# EAGLE schematic glassesBoard (EAGLE 9.2.2)
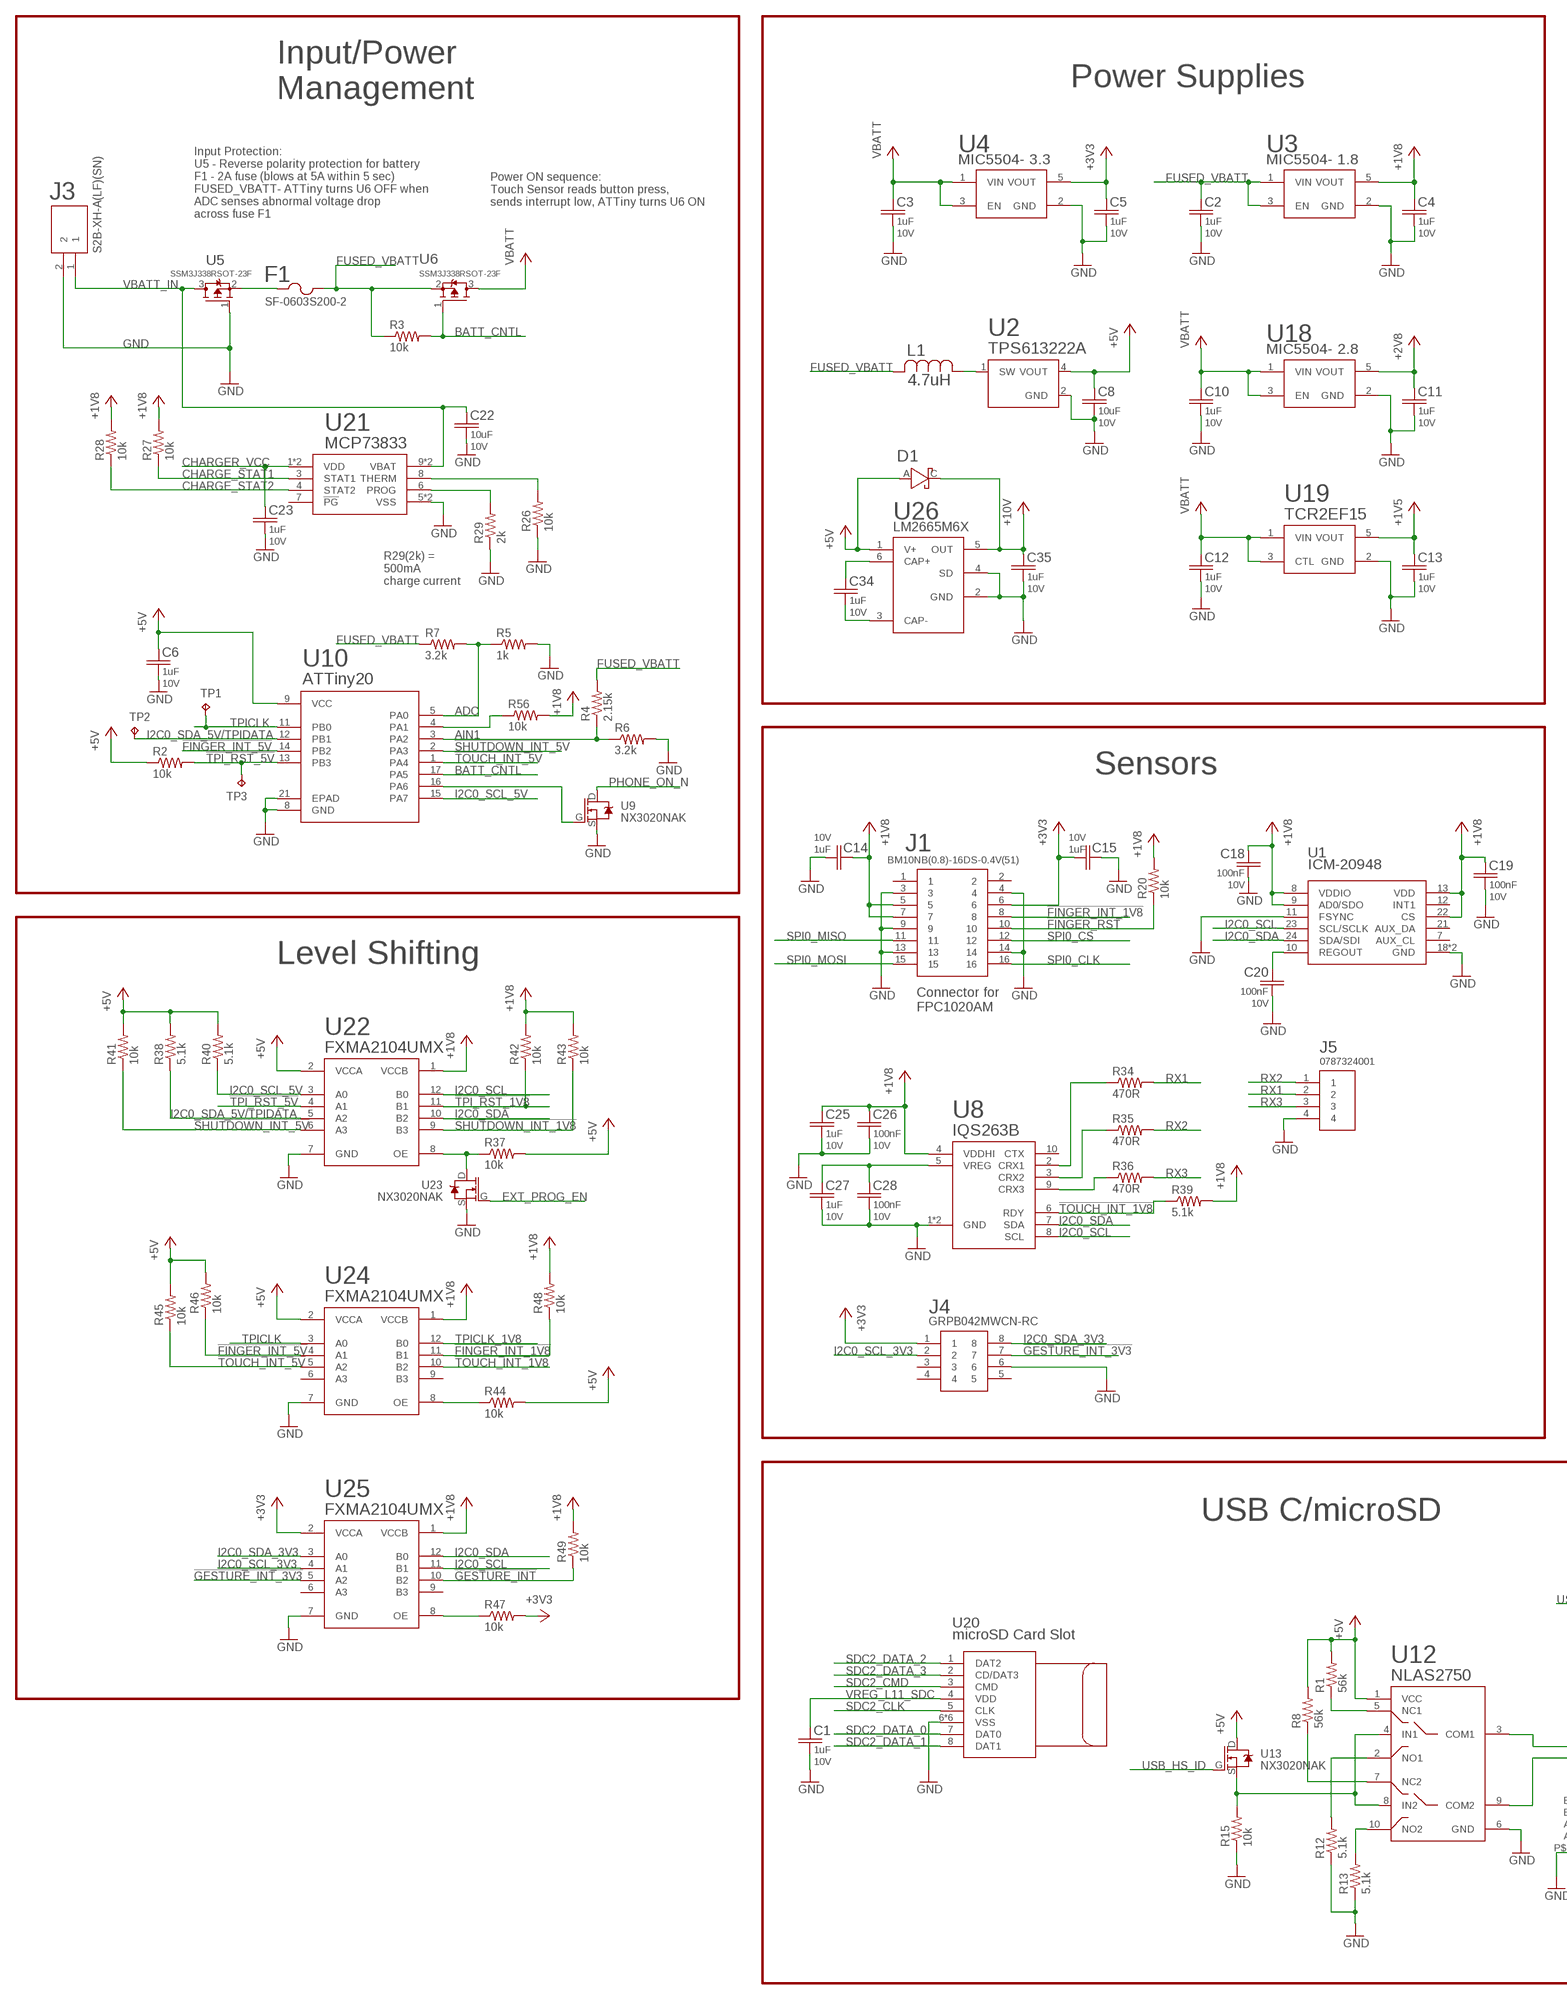
[diagram p0: schematic, sheet 1, part 1 of 2]
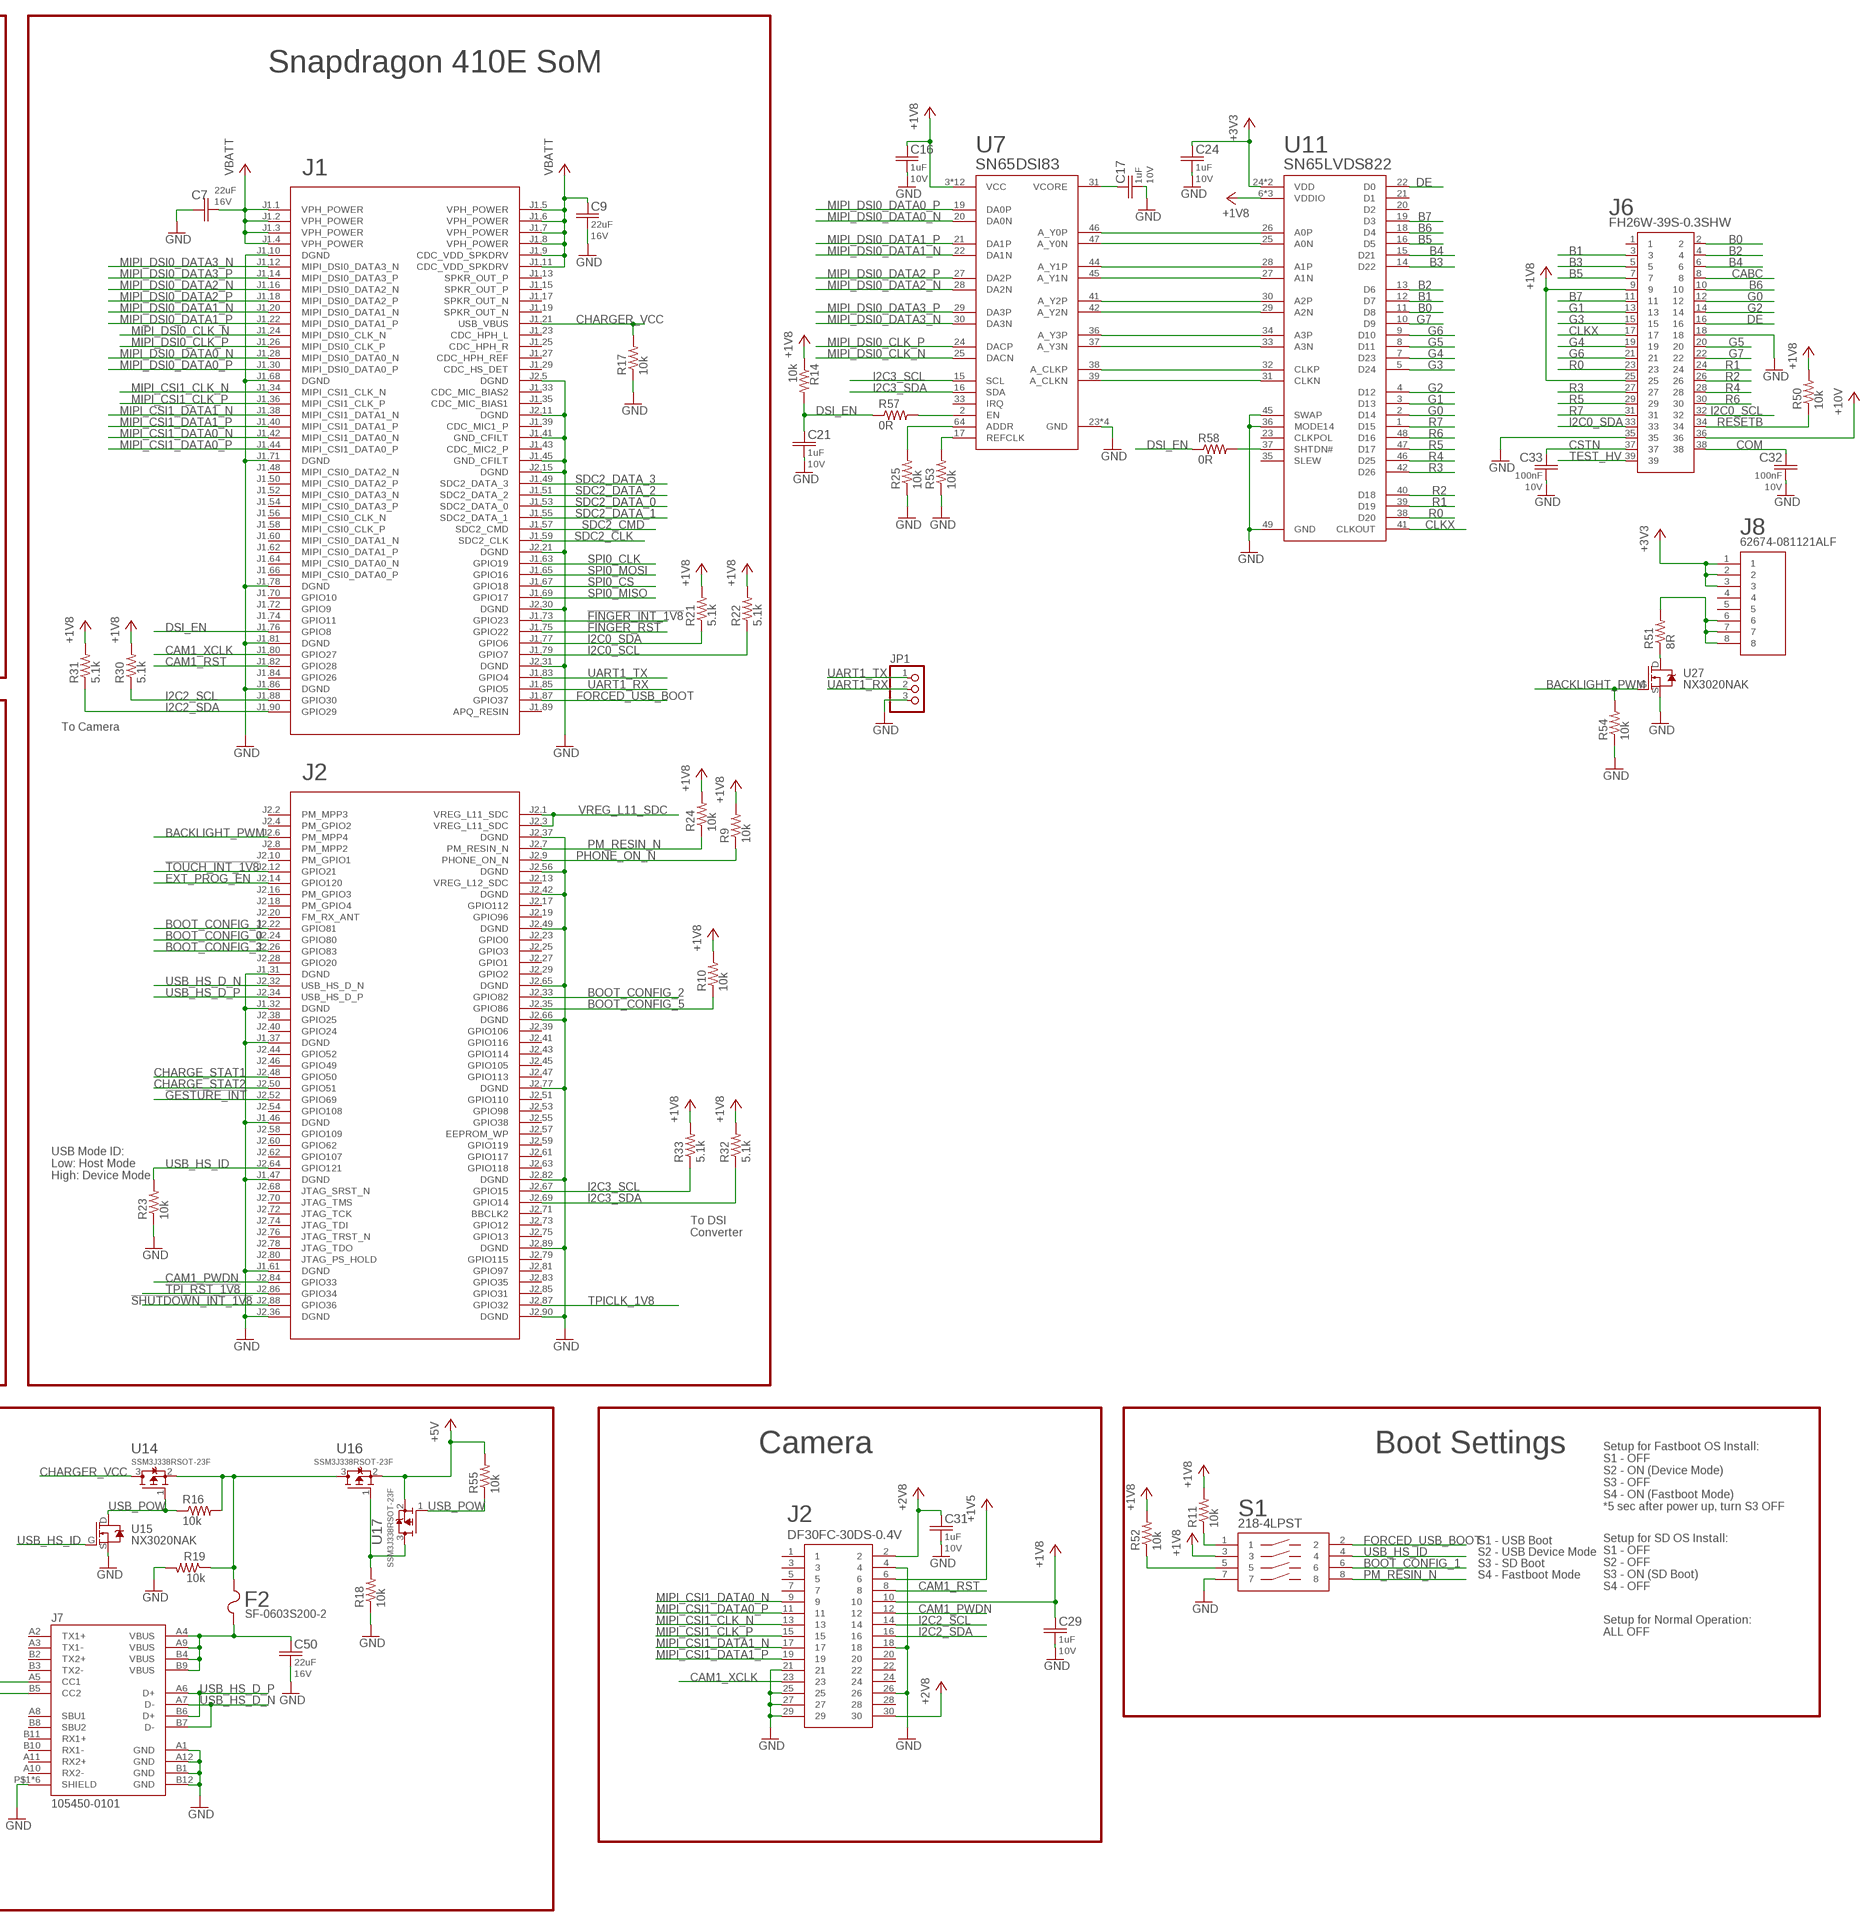
[diagram p1: schematic, sheet 1, part 2 of 2]

## Parts
C1  1uF  CL05A105MP5NNNC  [C0402]
C2  1uF  CL05A105MP5NNNC  [C0402]
C3  1uF  CL05A105MP5NNNC  [C0402]
C4  1uF  CL05A105MP5NNNC  [C0402]
C5  1uF  CL05A105MP5NNNC  [C0402]
C6  1uF  CL05A105MP5NNNC  [C0402]
C7  22uF  CL21A226MOCLRNC  [C0805]
C8  10uF  GRM188R61A106KE69D  [C0603]
C9  22uF  CL21A226MOCLRNC  [C0805]
C10  1uF  CL05A105MP5NNNC  [C0402]
C11  1uF  CL05A105MP5NNNC  [C0402]
C12  1uF  CL05A105MP5NNNC  [C0402]
C13  1uF  CL05A105MP5NNNC  [C0402]
C14  1uF  CL05A105MP5NNNC  [C0402]
C15  1uF  CL05A105MP5NNNC  [C0402]
C16  1uF  CL05A105MP5NNNC  [C0402]
C17  1uF  CL05A105MP5NNNC  [C0402]
C18  100nF  CL05A104MP5NNNC  [C0402]
C19  100nF  CL05A104MP5NNNC  [C0402]
C20  100nF  CL05A104MP5NNNC  [C0402]
C21  1uF  CL05A105MP5NNNC  [C0402]
C22  10uF  GRM188R61A106KE69D  [C0603]
C23  1uF  CL05A105MP5NNNC  [C0402]
C24  1uF  CL05A105MP5NNNC  [C0402]
C25  1uF  CL05A105MP5NNNC  [C0402]
C26  100nF  CL05A104MP5NNNC  [C0402]
C27  1uF  CL05A105MP5NNNC  [C0402]
C28  100nF  CL05A104MP5NNNC  [C0402]
C29  1uF  CL05A105MP5NNNC  [C0402]
C31  1uF  CL05A105MP5NNNC  [C0402]
C32  100nF  CL05A104MP5NNNC  [C0402]
C33  100nF  CL05A104MP5NNNC  [C0402]
C34  1uF  CL05A105MP5NNNC  [C0402]
C35  1uF  CL05A105MP5NNNC  [C0402]
C50  22uF  CL21A226MOCLRNC  [C0805]
D1  SDM03U40-7SC79  [SOD1608X70]
F1  SF-0603S200-2  [R0603]
F2  SF-0603S200-2  [R0603]
J1  BM10NB(0.8)-16DS-0.4V(51)  [BM10NB(0.8)-16DS-0.4V(51)]
J2  DF30FC-30DS-0.4V  [DF30FC-30DS-0.4V]
J3  S2B-XH-A(LF)(SN)  [S2B-XH-A(LF)(SN)]
J4  GRPB042MWCN-RC  [GRPB042MWCN-RC]
J5  0787324001  [0787324001]
J6  FH26W-39S-0.3SHW  [FH26W-39S-0.3SHW]
J7  105450-0101  [MOLEX_105450-0101]
J8  62674-081121ALF  [62674-081121ALF]
JP1  PINHD-1X3/90  [1X03/90]
L1  4.7uH  DFE252012P-4R7M=P2"  [1008]
R1  56k  RC0402JR-0756KL  [R0402]
R2  10k  RC0402JR-0710KL  [R0402]
R3  10k  RC0402JR-0710KL  [R0402]
R4  2.15k  RC0402FR-072K15L  [R0402]
R5  1k  RC0402FR-071KL  [R0402]
R6  3.2k  RT0402DRE073K2L  [R0402]
R7  3.2k  RT0402DRE073K2L  [R0402]
R8  56k  RC0402JR-0756KL  [R0402]
R9  10k  RC0402JR-0710KL  [R0402]
R10  10k  RC0402JR-0710KL  [R0402]
R11  10k  RC0402JR-0710KL  [R0402]
R12  5.1k  RC0402JR-075K1L  [R0402]
R13  5.1k  RC0402JR-075K1L  [R0402]
R14  10k  RC0402JR-0710KL  [R0402]
R15  10k  RC0402JR-0710KL  [R0402]
R16  10k  RC0402JR-0710KL  [R0402]
R17  10k  RC0402JR-0710KL  [R0402]
R18  10k  RC0402JR-0710KL  [R0402]
R19  10k  RC0402JR-0710KL  [R0402]
R20  10k  RC0402JR-0710KL  [R0402]
R21  5.1k  RC0402JR-075K1L  [R0402]
R22  5.1k  RC0402JR-075K1L  [R0402]
R23  10k  RC0402JR-0710KL  [R0402]
R24  10k  RC0402JR-0710KL  [R0402]
R25  10k  RC0402JR-0710KL  [R0402]
R26  10k  RC0402JR-0710KL  [R0402]
R27  10k  RC0402JR-0710KL  [R0402]
R28  10k  RC0402JR-0710KL  [R0402]
R29  2k  RC0402FR-072KL  [R0402]
R30  5.1k  RC0402JR-075K1L  [R0402]
R31  5.1k  RC0402JR-075K1L  [R0402]
R32  5.1k  RC0402JR-075K1L  [R0402]
R33  5.1k  RC0402JR-075K1L  [R0402]
R34  470R  RC0402JR-07470RL  [R0402]
R35  470R  RC0402JR-07470RL  [R0402]
R36  470R  RC0402JR-07470RL  [R0402]
R37  10k  RC0402JR-0710KL  [R0402]
R38  5.1k  RC0402JR-075K1L  [R0402]
R39  5.1k  RC0402JR-075K1L  [R0402]
R40  5.1k  RC0402JR-075K1L  [R0402]
R41  10k  RC0402JR-0710KL  [R0402]
R42  10k  RC0402JR-0710KL  [R0402]
R43  10k  RC0402JR-0710KL  [R0402]
R44  10k  RC0402JR-0710KL  [R0402]
R45  10k  RC0402JR-0710KL  [R0402]
R46  10k  RC0402JR-0710KL  [R0402]
R47  10k  RC0402JR-0710KL  [R0402]
R48  10k  RC0402JR-0710KL  [R0402]
R49  10k  RC0402JR-0710KL  [R0402]
R50  10k  RC0402JR-0710KL  [R0402]
R51  8R  RMCF0402JT8R20  [R0402]
R52  10k  RC0402JR-0710KL  [R0402]
R53  10k  RC0402JR-0710KL  [R0402]
R54  10k  RC0402JR-0710KL  [R0402]
R55  10k  RC0402JR-0710KL  [R0402]
R56  10k  RC0402JR-0710KL  [R0402]
R57  0R  RC0402JR-0710KL  [R0402]
R58  0R  RC0402JR-0710KL  [R0402]
S1  218-4LPST  [218-4LPST]
TP1  TPB2,54  [B2,54]
TP2  TPB2,54  [B2,54]
TP3  TPB2,54  [B2,54]
U1  ICM-20948  [QFN40P300X300X105-25N]
U2  TPS613222A  [SOT23-5]
U3  1.8  MIC5504-1.8SOT23-5  [SOT23-5]
U4  3.3  MIC5504-3.3  [SOT23-5]
U5  SSM3J338RSOT-23F  [SOTFL95P240X80-3]
U6  SSM3J338RSOT-23F  [SOTFL95P240X80-3]
U7  SN65DSI83-Q1S-PQFP-G64  [QFP50P1200X1200X120-65T300]
U8  IQS263BDFN10  [DFN10-3X3]
U9  NX3020NAK  [SOT-23_(TO-236AB)]
U10  ATTINY20-MMH  [20M2]
U11  SN65LVDS822VQFN48  [QFN50P700X700X100-49T515]
U12  NLAS2750  [UQFN10]
U13  NX3020NAK  [SOT-23_(TO-236AB)]
U14  SSM3J338RSOT-23F  [SOTFL95P240X80-3]
U15  NX3020NAK  [SOT-23_(TO-236AB)]
U16  SSM3J338RSOT-23F  [SOTFL95P240X80-3]
U17  SSM3J338RSOT-23F  [SOTFL95P240X80-3]
U18  2.8  MIC5504-2.8  [SOT23-5]
U19  TCR2EF15SOT-25  [SOT95P275X130-5]
U20  MICROSD  [MICROSD]
U21  MCP73833  [DFN10-3X3]
U22  FXMA2104UMX  [12MLP]
U23  NX3020NAK  [SOT-23_(TO-236AB)]
U24  FXMA2104UMX  [12MLP]
U25  FXMA2104UMX  [12MLP]
U26  LM2665M6XSOT23-6  [SOT95P280X145-6]
U27  NX3020NAK  [SOT-23_(TO-236AB)]
U$1  DART-SD410  [DART-SD410]

## Nets
!FINGER_INT_1V8: J1.8 R48.1 U24.11(B1) U$1.J1.73(GPIO23)
!FINGER_INT_5V: R46.1 U10.14(PB2) U24.4(A1)
!FINGER_RST: J1.10 R20.1 U$1.J1.75(GPIO22)
!GESTURE_INT: R49.1 U25.10(B2) U$1.J2.52(GPIO69)
!GESTURE_INT_3V3: J4.7 U25.5(A2)
!SHUTDOWN_INT_1V8: R43.1 U22.9(B3) U$1.J2.88(GPIO36)
!SHUTDOWN_INT_5V: R41.1 U10.2(PA3) U22.6(A3)
!TOUCH_INT_1V8: R39.1 U8.6(RDY) U24.10(B2) U$1.J2.12(GPIO21)
!TOUCH_INT_5V: R45.1 U10.1(PA4) U24.5(A2)
!TPI_RST_1V8: R42.1 U22.11(B1) U$1.J2.86(GPIO34)
!TPI_RST_5V: R2.2 TP3.TP U10.13(PB3) U22.4(A1)
+1V5: C13.1 J2.6 U19.5(VOUT)
+1V8: C4.1 C14.1 C16.1 C18.1 C19.1 C25.1 C26.1 C29.1 J1.5 J1.7 J2.10 J6.9 J6.25 R9.2 R10.2 R11.2 R14.1 R20.2 R21.2 R22.2 R24.2 R27.2 R28.2 R30.2 R31.2 R32.2 R33.2 R39.2 R42.2 R43.2 R48.2 R49.2 R50.2 R52.2 R56.2 S1.3 U1.8(VDDIO) U1.9(AD0/SDO) U1.13(VDD) U1.22(CS) U3.5(VOUT) U7.3(VCC) U7.14(VCC) U7.18(VCC) U7.32(VCC) U7.35(VCC) U7.40(VCC) U7.43(VCC) U7.48(VCC) U7.49(VCC) U7.55(VCC) U7.58(VCC) U7.63(VCC) U8.4(VDDHI) U11.6(VDDIO) U11.17(VDDIO) U11.43(VDDIO) U22.1(VCCB) U24.1(VCCB) U25.1(VCCB)
+2V8: C11.1 C31.1 J2.2 J2.30 U18.5(VOUT)
+3V3: C5.1 C15.2 C24.1 J1.6 J4.1 J8.1 J8.2 J8.3 R47.2 U4.5(VOUT) U11.24(VDD) U11.44(VDD) U25.2(VCCA)
+5V: C6.1 C8.1 D1.A R1.2 R2.1 R8.2 R37.2 R38.2 R40.2 R41.2 R44.2 R45.2 R46.2 R55.2 U2.4(VOUT) U10.9(VCC) U12.1(VCC) U13.D U16.2(S) U17.2(S) U22.2(VCCA) U24.2(VCCA) U26.1(V+)
+10V: C35.1 D1.C J6.36 U26.5(OUT)
ADC: R5.1 R7.2 U10.5(PA0)
AIN1: R4.1 R6.1 U10.3(PA2)
B0: J6.2 U11.11(D8)
B1: J6.3 U11.12(D7)
B2: J6.4 U11.13(D6)
B3: J6.5 U11.14(D22)
B4: J6.6 U11.15(D21)
B5: J6.7 U11.16(D5)
B6: J6.10 U11.18(D4)
B7: J6.11 U11.19(D3)
BACKLIGHT_PWM: R54.2 U27.G U$1.J2.6(PM_MPP4)
BATT_CNTL: R3.2 U6.1(G) U10.17(PA5)
BOOT_CONFIG_0: U$1.J2.24(GPIO80)
BOOT_CONFIG_1: S1.6 U$1.J2.22(GPIO81)
BOOT_CONFIG_2: U$1.J2.33(GPIO82)
BOOT_CONFIG_3: U$1.J2.26(GPIO83)
BOOT_CONFIG_5: R10.1 U$1.J2.35(GPIO86)
CABC: J6.8
CAM1_PWDN: J2.12 U$1.J2.84(GPIO33)
CAM1_RST: J2.8 U$1.J1.82(GPIO28)
CAM1_XCLK: J2.23 U$1.J1.80(GPIO27)
CHARGE_STAT1: R27.1 U21.3(STAT1) U$1.J2.48(GPIO50)
CHARGE_STAT2: R28.1 U21.4(STAT2) U$1.J2.50(GPIO51)
CHARGER_VCC: C23.1 R17.2 U14.3(D) U21.1(VDD) U21.2(VDD) U$1.J1.21(USB_VBUS)
CLKX: J6.17 U11.41(CLKOUT)
COM: C32.1 J6.38
CSTN: C33.1 J6.37
DE: J6.16 U11.22(D0)
DSI_EN: C21.1 R14.2 R57.1 R58.1 U$1.J1.76(GPIO8)
EXT_PROG_EN: U23.G U$1.J2.14(GPIO120)
FORCED_USB_BOOT: S1.2 U$1.J1.87(GPIO37)
FUSED_VBATT: C2.1 F1.2 L1.P$2 R3.1 R4.2 R7.1 U3.1(VIN) U3.3(EN) U6.2(S)
G0: J6.12 U11.2(D14)
G1: J6.13 U11.3(D13)
G2: J6.14 U11.4(D12)
G3: J6.15 U11.5(D24)
G4: J6.19 U11.7(D23)
G5: J6.20 U11.8(D11)
G6: J6.21 U11.9(D10)
G7: J6.22 U11.10(D9)
GND: C1.2 C2.2 C3.2 C4.2 C5.2 C6.2 C7.1 C8.2 C9.2 C10.2 C11.2 C12.2 C13.2 C14.2 C15.1 C16.2 C17.2 C18.2 C19.2 C20.2 C21.2 C22.2 C23.2 C24.2 C25.2 C26.2 C27.2 C28.2 C29.2 C31.2 C32.2 C33.2 C35.2 C50.2 J1.3 J1.4 J1.9 J1.13 J1.14 J2.4 J2.18 J2.21 J2.25 J2.26 J2.27 J2.29 J3.2 J4.6 J5.4 J6.18 J6.35 J7.A1(GND) J7.A12(GND) J7.B1(GND) J7.B12(GND) J7.P$1(SHIELD) J7.P$2(SHIELD) J7.P$3(SHIELD) J7.P$4(SHIELD) J7.P$5(SHIELD) J7.P$6(SHIELD) JP1.3 R5.2 R6.2 R12.1 R13.1 R15.1 R17.1 R18.1 R19.2 R23.1 R25.1 R26.1 R29.1 R53.1 R54.1 S1.7 U1.11(FSYNC) U1.18(GND) U1.20(GND) U2.2(GND) U3.2(GND) U4.2(GND) U5.1(G) U7.23(GND) U7.26(GND) U7.52(GND) U7.65(GND) U8.1(GND) U8.EXP(GND) U9.S U10.8(GND) U10.21(EPAD) U11.36(MODE14) U11.45(SWAP) U11.49(GND) U12.6(GND) U15.S U18.2(GND) U19.2(GND) U20.6(VSS) U20.9(VSS) U20.10(VSS) U20.11(VSS) U20.12(VSS) U20.13(VSS) U21.5(VSS) U21.EXP(VSS) U22.7(GND) U23.S U24.7(GND) U25.7(GND) U26.2(GND) U26.4(SD) U27.S U$1.J1.10(DGND) U$1.J1.31(DGND) U$1.J1.32(DGND) U$1.J1.37(DGND) U$1.J1.41(GND_CFILT) U$1.J1.45(GND_CFILT) U$1.J1.46(DGND) U$1.J1.47(DGND) U$1.J1.61(DGND) U$1.J1.68(DGND) U$1.J1.71(DGND) U$1.J1.78(DGND) U$1.J1.81(DGND) U$1.J1.86(DGND) U$1.J2.5(DGND) U$1.J2.11(DGND) U$1.J2.15(DGND) U$1.J2.21(DGND) U$1.J2.30(DGND) U$1.J2.31(DGND) U$1.J2.36(DGND) U$1.J2.37(DGND) U$1.J2.42(DGND) U$1.J2.49(DGND) U$1.J2.56(DGND) U$1.J2.65(DGND) U$1.J2.66(DGND) U$1.J2.77(DGND) U$1.J2.82(DGND) U$1.J2.89(DGND) U$1.J2.90(DGND)
I2C0_SCL: J6.32 R22.1 U1.23(SCL/SCLK) U8.8(SCL) U22.12(B0) U25.11(B1) U$1.J1.79(GPIO7)
I2C0_SCL_3V3: J4.2 U25.4(A1)
I2C0_SCL_5V: R40.1 U10.15(PA7) U22.3(A0)
I2C0_SDA: J6.33 R21.1 U1.24(SDA/SDI) U8.7(SDA) U22.10(B2) U25.12(B0) U$1.J1.77(GPIO6)
I2C0_SDA_3V3: J4.8 U25.3(A0)
I2C0_SDA_5V/TPIDATA: R38.1 TP2.TP U10.12(PB1) U22.5(A2)
I2C2_SCL: J2.14 R30.1 U$1.J1.88(GPIO30)
I2C2_SDA: J2.16 R31.1 U$1.J1.90(GPIO29)
I2C3_SCL: R33.1 U7.15(SCL) U$1.J2.67(GPIO15)
I2C3_SDA: R32.1 U7.16(SDA) U$1.J2.69(GPIO14)
MIPI_CSI1_CLK_N [wide_diff_pair]: J2.13 U$1.J1.34(MIPI_CSI1_CLK_N)
MIPI_CSI1_CLK_P [wide_diff_pair]: J2.15 U$1.J1.36(MIPI_CSI1_CLK_P)
MIPI_CSI1_DATA0_N [wide_diff_pair]: J2.9 U$1.J1.42(MIPI_CSI1_DATA0_N)
MIPI_CSI1_DATA0_P [wide_diff_pair]: J2.11 U$1.J1.44(MIPI_CSI1_DATA0_P)
MIPI_CSI1_DATA1_N [wide_diff_pair]: J2.17 U$1.J1.38(MIPI_CSI1_DATA1_N)
MIPI_CSI1_DATA1_P [wide_diff_pair]: J2.19 U$1.J1.40(MIPI_CSI1_DATA1_P)
MIPI_DSI0_CLK_N: U7.25(DACN) U$1.J1.24(MIPI_DSI0_CLK_N)
MIPI_DSI0_CLK_P: U7.24(DACP) U$1.J1.26(MIPI_DSI0_CLK_P)
MIPI_DSI0_DATA0_N: U7.20(DA0N) U$1.J1.28(MIPI_DSI0_DATA0_N)
MIPI_DSI0_DATA0_P: U7.19(DA0P) U$1.J1.30(MIPI_DSI0_DATA0_P)
MIPI_DSI0_DATA1_N: U7.22(DA1N) U$1.J1.20(MIPI_DSI0_DATA1_N)
MIPI_DSI0_DATA1_P: U7.21(DA1P) U$1.J1.22(MIPI_DSI0_DATA1_P)
MIPI_DSI0_DATA2_N: U7.28(DA2N) U$1.J1.16(MIPI_DSI0_DATA2_N)
MIPI_DSI0_DATA2_P: U7.27(DA2P) U$1.J1.18(MIPI_DSI0_DATA2_P)
MIPI_DSI0_DATA3_N: U7.30(DA3N) U$1.J1.12(MIPI_DSI0_DATA3_N)
MIPI_DSI0_DATA3_P: U7.29(DA3P) U$1.J1.14(MIPI_DSI0_DATA3_P)
N$1: U7.46(A_Y0P) U11.26(A0P)
N$2: F1.1 U5.2(S)
N$3: U7.47(A_Y0N) U11.25(A0N)
N$4: U7.44(A_Y1P) U11.28(A1P)
N$5: U7.45(A_Y1N) U11.27(A1N)
N$6: L1.P$1 U2.1(SW)
N$7: U7.41(A_Y2P) U11.30(A2P)
N$8: U7.42(A_Y2N) U11.29(A2N)
N$9: U7.36(A_Y3P) U11.34(A3P)
N$10: U7.37(A_Y3N) U11.33(A3N)
N$11: U7.38(A_CLKP) U11.32(CLKP)
N$12: U7.39(A_CLKN) U11.31(CLKN)
N$13: U9.G U10.16(PA6)
N$14: R11.1 S1.1
N$15: R53.2 U7.17(REFCLK)
N$16: J7.B5(CC2) U12.9(COM2)
N$17: J7.A5(CC1) U12.3(COM1)
N$18: R13.2 U12.10(NO2)
N$19: R12.2 U12.2(NO1)
N$20: R1.1 U12.5(NC1)
N$21: R8.1 U12.7(NC2)
N$22: R15.2 U12.4(IN1) U12.8(IN2) U13.S
N$23: R57.2 U7.2(EN)
N$24: F2.2 R16.2 R19.1 U14.2(S) U16.3(D)
N$25: R18.2 U16.1(G) U17.3(D)
N$26: C17.1 U7.31(VCORE)
N$27: R26.2 U21.8(THERM)
N$28: R29.2 U21.6(PROG)
N$29: C20.1 U1.10(REGOUT)
N$30: R36.1 U8.9(CRX3)
N$31: R35.1 U8.3(CRX2)
N$32: R34.1 U8.2(CRX1)
N$33: R37.1 U22.8(OE) U23.D
N$34: R52.1 S1.5
N$35: R44.1 U24.8(OE)
N$36: R47.1 U25.8(OE)
N$37: C27.1 C28.1 U8.5(VREG)
N$38: C34.1 U26.6(CAP+)
N$39: R25.2 U7.64(ADDR)
N$40: C34.2 U26.3(CAP-)
N$41: R51.1 U27.D
N$42: R58.2 U11.37(SHTDN#)
N$43: J8.6 J8.7 J8.8 R51.2
N$45: R56.1 U10.4(PA1)
N$51: C50.1 F2.1 J7.A4(VBUS) J7.A9(VBUS) J7.B4(VBUS) J7.B9(VBUS)
P$1: C3.1 C7.2 C9.1 C10.1 C12.1 U4.1(VIN) U4.3(EN) U6.3(D) U18.1(VIN) U18.3(EN) U19.1(VIN) U19.3(CTL) U$1.J1.1(VPH_POWER) U$1.J1.2(VPH_POWER) U$1.J1.3(VPH_POWER) U$1.J1.4(VPH_POWER) U$1.J1.5(VPH_POWER) U$1.J1.6(VPH_POWER) U$1.J1.7(VPH_POWER) U$1.J1.8(VPH_POWER) U$1.J1.9(CDC_VDD_SPKDRV) U$1.J1.11(CDC_VDD_SPKDRV) ; supply symbol labelled VBATT
PHONE_ON_N: R9.1 U9.D U$1.J2.9(PHONE_ON_N)
PM_RESIN_N: R24.1 S1.8 U$1.J2.7(PM_RESIN_N)
R0: J6.23 U11.38(D20)
R1: J6.24 U11.39(D19)
R2: J6.26 U11.40(D18)
R3: J6.27 U11.42(D26)
R4: J6.28 U11.46(D25)
R5: J6.29 U11.47(D17)
R6: J6.30 U11.48(D16)
R7: J6.31 U11.1(D15)
RESETB: J6.34 R50.1
RX1: J5.2 R34.2
RX2: J5.1 R35.2
RX3: J5.3 R36.2
SDC2_CLK: U20.5(CLK) U$1.J1.59(SDC2_CLK)
SDC2_CMD: U20.3(CMD) U$1.J1.57(SDC2_CMD)
SDC2_DATA_0: U20.7(DAT0) U$1.J1.53(SDC2_DATA_0)
SDC2_DATA_1: U20.8(DAT1) U$1.J1.55(SDC2_DATA_1)
SDC2_DATA_2: U20.1(DAT2) U$1.J1.51(SDC2_DATA_2)
SDC2_DATA_3: U20.2(CD/DAT3) U$1.J1.49(SDC2_DATA_3)
SPI0_CLK: J1.16 U$1.J1.63(GPIO19)
SPI0_CS: J1.12 U$1.J1.67(GPIO18)
SPI0_MISO: J1.11 U$1.J1.69(GPIO17)
SPI0_MOSI: J1.15 U$1.J1.65(GPIO16)
TEST_HV: J6.39
TPICLK: TP1.TP U10.11(PB0) U24.3(A0)
TPICLK_1V8: U24.12(B0) U$1.J2.87(GPIO32)
UART1_RX: JP1.2 U$1.J1.85(GPIO5)
UART1_TX: JP1.1 U$1.J1.83(GPIO4)
USB_HS_D_N: J7.A7(D-) J7.B7(D-) U$1.J2.32(USB_HS_D_N)
USB_HS_D_P: J7.A6(D+) J7.B6(D+) U$1.J2.34(USB_HS_D_P)
USB_HS_ID: R23.2 S1.4 U13.G U15.G U$1.J2.64(GPIO121)
USB_POW: R16.1 R55.1 U14.1(G) U15.D U17.1(G)
VBATT_IN: C22.1 J3.1 U5.3(D) U21.9(VBAT) U21.10(VBAT)
VREG_L11_SDC: C1.1 U20.4(VDD) U$1.J2.1(VREG_L11_SDC) U$1.J2.3(VREG_L11_SDC)
Unconnected: J1.1 J1.2 J2.1 J2.3 J2.5 J2.7 J2.20 J2.22 J2.24 J2.28 J4.3 J4.4 J4.5 J6.1 J7.A2(TX1+) J7.A3(TX1-) J7.A8(SBU1) J7.A10(RX2-) J7.A11(RX2+) J7.B2(TX2+) J7.B3(TX2-) J7.B8(SBU2) J7.B10(RX1-) J7.B11(RX1+) J8.4 J8.5 U1.7(AUX_CL) U1.12(INT1) U1.21(AUX_DA) U7.33(IRQ) U8.10(CTX) U11.20(D2) U11.21(D1) U11.23(CLKPOL) U11.35(SLEW) U21.7(!PG) U24.6(A3) U24.9(B3) U25.6(A3) U25.9(B3) U$1.J1.13(SPKR_OUT_P) U$1.J1.15(SPKR_OUT_P) U$1.J1.17(SPKR_OUT_N) U$1.J1.19(SPKR_OUT_N) U$1.J1.23(CDC_HPH_L) U$1.J1.25(CDC_HPH_R) U$1.J1.27(CDC_HPH_REF) U$1.J1.29(CDC_HS_DET) U$1.J1.33(CDC_MIC_BIAS2) U$1.J1.35(CDC_MIC_BIAS1) U$1.J1.39(CDC_MIC1_P) U$1.J1.43(CDC_MIC2_P) U$1.J1.48(MIPI_CSI0_DATA2_N) U$1.J1.50(MIPI_CSI0_DATA2_P) U$1.J1.52(MIPI_CSI0_DATA3_N) U$1.J1.54(MIPI_CSI0_DATA3_P) U$1.J1.56(MIPI_CSI0_CLK_N) U$1.J1.58(MIPI_CSI0_CLK_P) U$1.J1.60(MIPI_CSI0_DATA1_N) U$1.J1.62(MIPI_CSI0_DATA1_P) U$1.J1.64(MIPI_CSI0_DATA0_N) U$1.J1.66(MIPI_CSI0_DATA0_P) U$1.J1.70(GPIO10) U$1.J1.72(GPIO9) U$1.J1.74(GPIO11) U$1.J1.84(GPIO26) U$1.J1.89(APQ_RESIN) U$1.J2.2(PM_MPP3) U$1.J2.4(PM_GPIO2) U$1.J2.8(PM_MPP2) U$1.J2.10(PM_GPIO1) U$1.J2.13(VREG_L12_SDC) U$1.J2.16(PM_GPIO3) U$1.J2.17(GPIO112) U$1.J2.18(PM_GPIO4) U$1.J2.19(GPIO96) U$1.J2.20(FM_RX_ANT) U$1.J2.23(GPIO0) U$1.J2.25(GPIO3) U$1.J2.27(GPIO1) U$1.J2.28(GPIO20) U$1.J2.29(GPIO2) U$1.J2.38(GPIO25) U$1.J2.39(GPIO106) U$1.J2.40(GPIO24) U$1.J2.41(GPIO116) U$1.J2.43(GPIO114) U$1.J2.44(GPIO52) U$1.J2.45(GPIO105) U$1.J2.46(GPIO49) U$1.J2.47(GPIO113) U$1.J2.51(GPIO110) U$1.J2.53(GPIO98) U$1.J2.54(GPIO108) U$1.J2.55(GPIO38) U$1.J2.57(EEPROM_WP) U$1.J2.58(GPIO109) U$1.J2.59(GPIO119) U$1.J2.60(GPIO62) U$1.J2.61(GPIO117) U$1.J2.62(GPIO107) U$1.J2.63(GPIO118) U$1.J2.68(JTAG_SRST_N) U$1.J2.70(JTAG_TMS) U$1.J2.71(BBCLK2) U$1.J2.72(JTAG_TCK) U$1.J2.73(GPIO12) U$1.J2.74(JTAG_TDI) U$1.J2.75(GPIO13) U$1.J2.76(JTAG_TRST_N) U$1.J2.78(JTAG_TDO) U$1.J2.79(GPIO115) U$1.J2.80(JTAG_PS_HOLD) U$1.J2.81(GPIO97) U$1.J2.83(GPIO35) U$1.J2.85(GPIO31)

## Notes on the sheet
- Snapdragon 410E SoM
- Power Supplies
- Input/Power
  Management
- Power ON sequence:
  Touch Sensor reads button press,
  sends interrupt low, ATTiny turns U6 ON
- Input Protection:
  U5 - Reverse polarity protection for battery
  F1 - 2A fuse (blows at 5A within 5 sec)
  FUSED_VBATT- ATTiny turns U6 OFF when
  ADC senses abnormal voltage drop
  across fuse F1
- R29(2k) =
  500mA 
  charge current
- To Camera
- Sensors
- Level Shifting
- Connector for
  FPC1020AM
- USB Mode ID:
  Low: Host Mode
  High: Device Mode
- To DSI
  Converter
- Camera | Boot Settings
- USB C/microSD
- Setup for Fastboot OS Install:
  S1 - OFF
  S2 - ON (Device Mode)
  S3 - OFF
  S4 - ON (Fastboot Mode)
  *5 sec after power up, turn S3 OFF
- S1 - USB Boot
- S2 - USB Device Mode
- S3 - SD Boot
- S4 - Fastboot Mode
- Setup for SD OS Install:
  S1 - OFF
  S2 - OFF
  S3 - ON (SD Boot)
  S4 - OFF
- Setup for Normal Operation:
  ALL OFF

## Library data of the parts
C1-C6 C10-C17 C21 C23-C25 C27 C29 C31 C34 C35 = thanics-capacitor:CL05A105MP5NNNC; RATING: 10V
C7 C9 C50 = thanics-capacitor:CL21A226MOCLRNC; RATING: 16V
C8 C22 = thanics-capacitor:GRM188R61A106KE69D; RATING: 10V
C18-C20 C26 C28 C32 C33 = thanics-capacitor:CL05A104MP5NNNC; RATING: 10V
D1 = glasses:SDM03U40-7
F1 F2 = thanics-resistor:SF-0603S200-2
J1 = thanics-connector:BM10NB(0.8)-16DS-0.4V(51)
J2 = thanics-connector:DF30FC-30DS-0.4V
J3 = thanics-connector:S2B-XH-A(LF)(SN)
J4 = thanics-connector:GRPB042MWCN-RC
J5 = thanics-connector:0787324001
J6 = thanics-connector:FH26W-39S-0.3SHW
J7 = 105450-0101:105450-0101: USB Shielded I/O Receptacle; Type C; Right Angle; Surface Mount; Gold over Nickel; DESCRIPTION: USB Shielded I/O Receptacle; Type C; Right Angle; Surface Mount; Gold over Nickel; DIGI-KEY_PART_NUMBER: WM12856CT-ND; DIGI-KEY_PURCHASE_URL: https://www.digikey.com/product-detail/en/molex-llc/1054500101/WM12856CT-ND/5843891?utm_source=snapeda&utm_medium=aggregator&utm_campaign=symbol; MF: Molex; MP: 1054500101; PACKAGE: None
J8 = thanics-connector:62674-081121ALF
JP1 = pinhead:PINHD-1X3: PIN HEADER
L1 = glasses:DFE252012P-4R7M=P2
R1 R8 = thanics-resistor:RC0402JR-0756KL; TOL: 5%
R2 R3 R9-R11 R14-R20 R23-R28 R37 R41-R50 R52-R56 = thanics-resistor:RC0402JR-0710KL; TOL: 5%
R4 = thanics-resistor:RC0402FR-072K15L; TOL: 1%
R5 = thanics-resistor:RC0402FR-071KL
R6 R7 = thanics-resistor:RT0402DRE073K2L
R12 R13 R21 R22 R30-R33 R38-R40 = thanics-resistor:RC0402JR-075K1L; TOL: 5%
R29 = thanics-resistor:RC0402FR-072KL; TOL: 1%
R34-R36 = thanics-resistor:RC0402JR-07470RL; TOL: 5%
R51 = thanics-resistor:RMCF0402JT8R20; TOL: 5%
R57 R58 = thanics-resistor:RC0402JR-0710KL; TOL: 5%; VALUE: 10k
S1 = glasses:218-4LPST
TP1-TP3 = testpad:TP: Test pad
U1 = ICM-20948-mpu:ICM-20948
U2 = glasses:TPS613222A
U3 = glasses:MIC5504-1.8
U4 = glasses:MIC5504-3.3
U5 U6 U14 U16 U17 = glasses:SSM3J338R
U7 = glasses:SN65DSI83-Q1
U8 = glasses:IQS263B
U9 U13 U15 U23 U27 = glasses:NX3020NAK; PART#: NX3020NAK
U10 = attiny20:ATTINY20-MMH; MANUFACTURER_PART_NUMBER: ATTINY20MMH; VENDOR: Atmel
U11 = glasses:SN65LVDS822
U12 = glasses:NLAS2750
U18 = glasses:MIC5504-2.8
U19 = glasses:TCR2EF15
U20 = glasses:MICROSD
U21 = glasses:MCP73833
U22 U24 U25 = glasses:FXMA2104UMX
U26 = glasses:LM2665M6X
U$1 = glasses:DART-SD410

## Net classes
1 wide_diff_pair: width 0.127 mm, drill 0.305 mm, clearance 0.127 mm